# Altium schematic sheet LM7310.SchDoc
size A; SheetNumber: 9; SheetTotal: 9
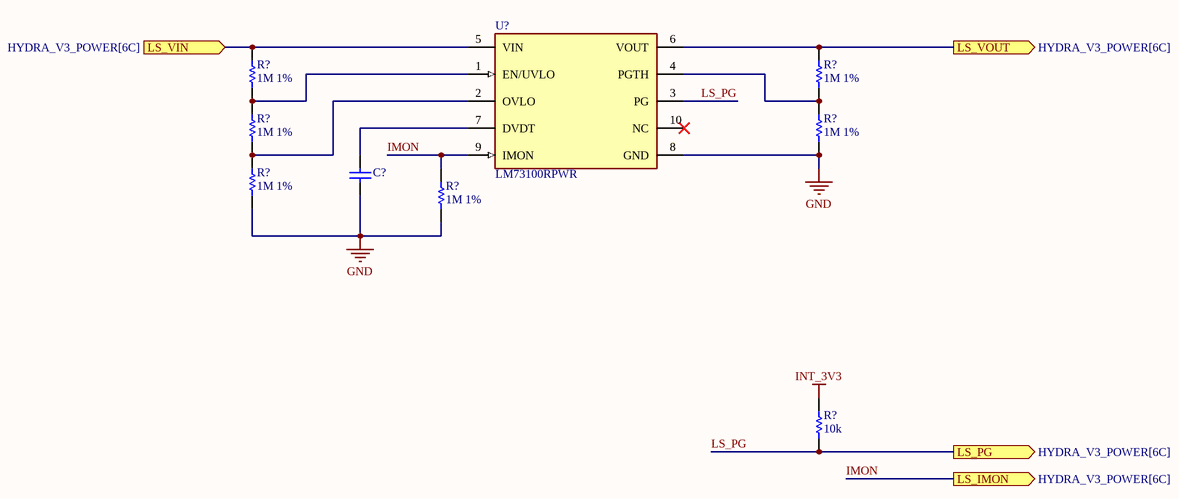
[diagram p0: LM7310.SchDoc]

## Parts
(Parts that share a designator on the sheet are numbered #1, #2 ... from top to bottom, then left to right.)
C?  CAP 3.3nF 50V 0402(1005)  [CAPC0402(1005)60_L]  (value not drawn)
R?#1  1M 1%  [R0603B]
R?#2  1M 1%  [R0603B]
R?#3  1M 1%  [R0603B]
R?#4  1M 1%  [R0603B]
R?#5  1M 1%  [R0603B]
R?#6  1M 1%  [R0603B]
R?#7  10k  [R0603B]
U?  LM73100RPWR  [FP-RPW0010A-MFG]

## Ports
LS_IMON (out, see HYDRA_V3_POWER[6C]), LS_PG (out, see HYDRA_V3_POWER[6C]), LS_VIN (in, see HYDRA_V3_POWER[6C]), LS_VOUT (out, see HYDRA_V3_POWER[6C])

## Nets
GND: C?.1 R?#4.1 R?#5.1 R?#6.1 U?.8(GND)
INT_3V3: R?#7.2
IMON: R?#6.2 U?.9(IMON) ; port LS_IMON
LS_PG: R?#7.1 U?.3(PG) ; port LS_PG
LS_VIN: R?#1.2 U?.5(VIN) ; port LS_VIN
LS_VOUT: R?#2.2 U?.6(VOUT) ; port LS_VOUT
NetC?_2: C?.2 U?.7(DVDT)
NetR?#1_1: R?#1.1 R?#3.2 U?.1(EN/UVLO)
NetR?#2_1: R?#2.1 R?#4.2 U?.4(PGTH)
NetR?#3_1: R?#3.1 R?#5.2 U?.2(OVLO)

Not connected (* = marked no-connect by the designer): U? 10(NC)*

## Library data of the parts
C? = CMP-1034-01778-1: CAP 3.3nF 50V ±5% 0402 (1005 Metric) Thickness 0.6mm SMD; Case-Metric: 1005; Case-EIA: 0402; Tolerance: Â±5%; Max Thickness: 0.6 mm; Technology: SMT; Value: 3.3nF; Rated Voltage: 50 V
R?#1-R?#7 = CMP-009-00002-14: Resistor
U? = CMP-04910-000122-1: 2.7-V TO 23-V, 5.5-A IDEAL DIODE; RoHS Compliant: Yes